# Altium schematic sheet Sheet2.SchDoc
size B; Organization: Altium Limited; Address1: L3, 12a Rodborough Rd; Address2: Frenchs Forest; Address3: NSW; Address4: Australia 2086
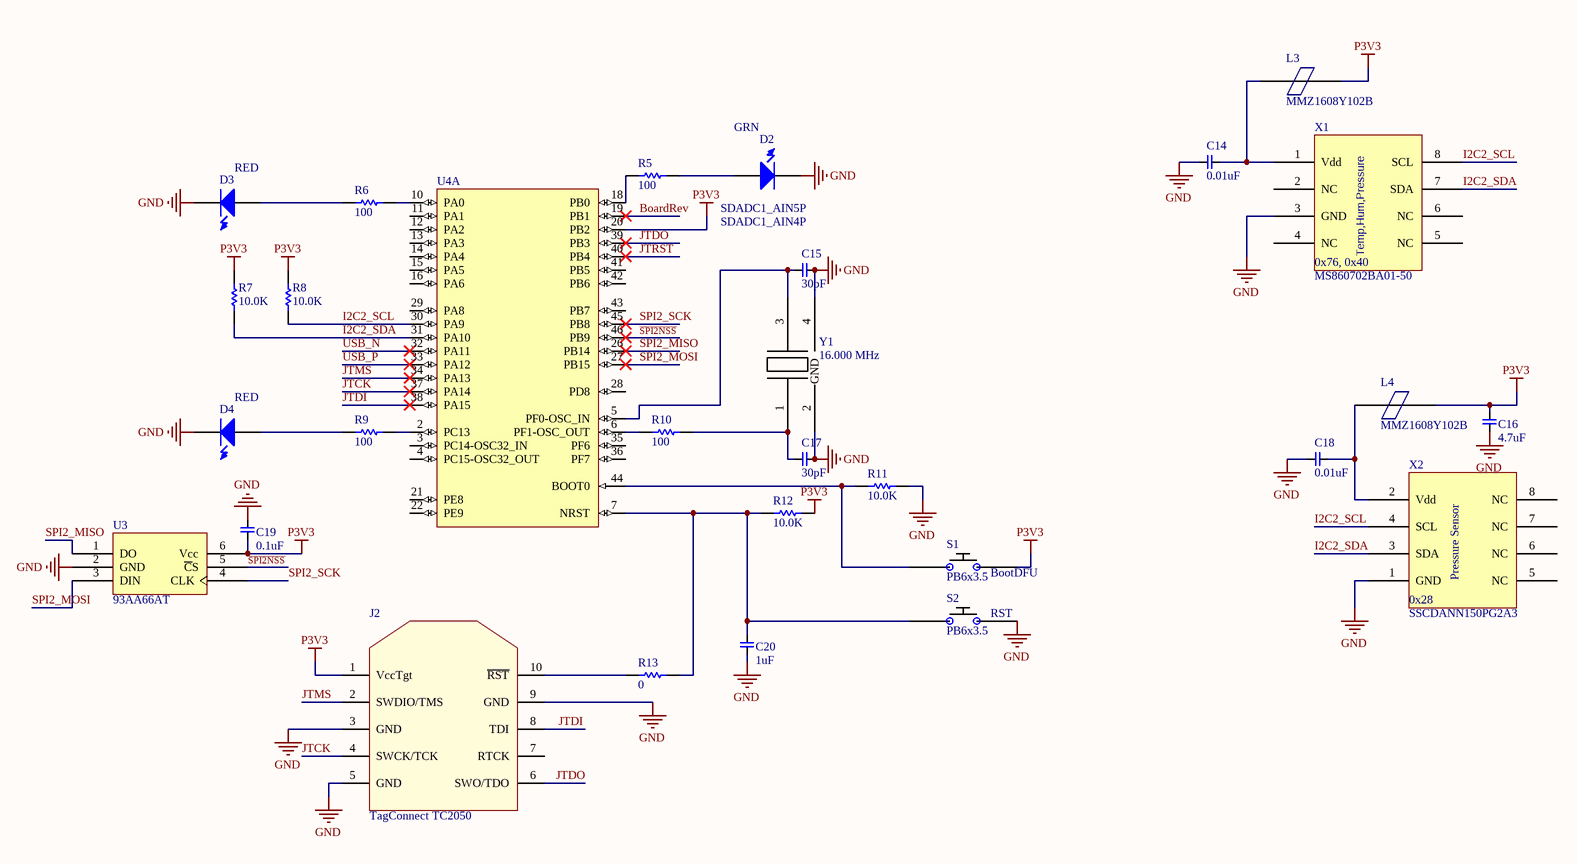
[diagram p0: Sheet2.SchDoc]

## Parts
C14  0.01uF  [CAP0402]
C15  30pF  [CAP0402]
C16  4.7uF  [CAP0603]
C17  30pF  [CAP0402]
C18  0.01uF  [CAP0402]
C19  0.1uF  [CAP0402]
C20  1uF  [CAP0402]
D2  GRN  [KINGBRIGHT_LED]
D3  RED  [KINGBRIGHT_LED]
D4  RED  [KINGBRIGHT_LED]
J2  TagConnect TC2050  [TC2050-IDC]  (no BOM)
L3  MMZ1608Y102B  [INDC1608X06N]
L4  MMZ1608Y102B  [INDC1608X06N]
R5  100  [RES0402]
R6  100  [RES0402]
R7  10.0K  [RES0402]
R8  10.0K  [RES0402]
R9  100  [RES0402]
R10  100  [RES0402]
R11  10.0K  [RES0402]
R12  10.0K  [RES0402]
R13  0  [RES0402]
S1  PB6x3.5  [PTS635]
S2  PB6x3.5  [PTS635]
U3  93AA66AT  [SOT-23-OT6_M]
U4  (no value)  [STM-LQFP48_N]  (part A of 2)
X1  MS860702BA01-50  [TETempHumidityPressSens]
X2  SSCDANN150PG2A3  [HoneywellPsenseDIP]
Y1  16.000 MHz  [CRYSTAL_SMD_3.2x2.5]

## Nets
GND: C14.2 C15.1 C16.2 C17.1 C18.2 C19.2 C20.1 D2.2(K) D3.2(K) D4.2(K) J2.3(GND) J2.5(GND) J2.9(GND) R11.2 S2.2 U3.2(GND) X1.3(GND) X2.1(GND) Y1.2(GND) Y1.4
P3V3: C16.1 C19.1 J2.1(VccTgt) L3.2 L4.2 R7.1 R8.1 R12.2 S1.2 U3.6(Vcc) U4.20(PB2)
~{SPI2NSS}: U3.5(~{C}S) U4.46(PB9)
BoardRev: U4.19(PB1)
I2C2_SCL: R8.2 U4.30(PA9) X1.8(SCL) X2.4(SCL)
I2C2_SDA: R7.2 U4.31(PA10) X1.7(SDA) X2.3(SDA)
JTCK: J2.4(SWCK/TCK) U4.37(PA14)
JTDI: J2.8(TDI) U4.38(PA15)
JTDO: J2.6(SWO/TDO) U4.39(PB3)
JTMS: J2.2(SWDIO/TMS) U4.34(PA13)
JTRST: U4.40(PB4)
SPI2_MISO: U3.1(DO) U4.26(PB14)
SPI2_MOSI: U3.3(DIN) U4.27(PB15)
SPI2_SCK: U3.4(CLK) U4.45(PB8)
USB_N: U4.32(PA11)
USB_P: U4.33(PA12)
NetC14_1: C14.1 L3.1 X1.1(Vdd)
NetC15_2: C15.2 U4.5(PF0-OSC_IN) Y1.3
NetC17_2: C17.2 R10.2 Y1.1
NetC18_1: C18.1 L4.1 X2.2(Vdd)
NetC20_2: C20.2 R12.1 R13.2 S2.1 U4.7(NRST)
NetD2_1: D2.1(A) R5.2
NetD3_1: D3.1(A) R6.1
NetD4_1: D4.1(A) R9.1
NetJ2_10: J2.10(~{RST}) R13.1
NetR5_1: R5.1 U4.18(PB0)
NetR6_2: R6.2 U4.10(PA0)
NetR9_2: R9.2 U4.2(PC13)
NetR10_1: R10.1 U4.6(PF1-OSC_OUT)
NetR11_1: R11.1 S1.1 U4.44(BOOT0)

Not connected (* = marked no-connect by the designer): J2 7(RTCK); U4 3(PC14-OSC32_IN) 4(PC15-OSC32_OUT) 11(PA1) 12(PA2) 13(PA3) 14(PA4) 15(PA5) 16(PA6) 21(PE8) 22(PE9) 28(PD8) 29(PA8) 35(PF6) 36(PF7) 41(PB5) 42(PB6) 43(PB7); X1 2(NC) 4(NC) 5(NC) 6(NC); X2 5(NC) 6(NC) 7(NC) 8(NC)

## Notes on the sheet
- (near D2) SDADC1_AIN5P
- SDADC1_AIN4P
- (near S1) BootDFU
- (near S2) RST
- Title
- Size:
- Date:
- File:
- C
- Number:
- Time:
- Revision:
- Sheet
- of
- (in symbol MS860702BA01-50) Temp,Hum,Pressure; 0x76, 0x40
- (in symbol SSCDANN150PG2A3) Pressure Sensor; 0x28

## Library data of the parts
C14 C18 = 514: CAP 0.01uF +/-20% 50V X6S 0402; Manufacturer: TDK; Manufacturer PN: C1005X6S1H103M; ID: 514; PkgCode: 0402; Value: 0.01uF; Tolerance: +/-20%; Voltage: 50V; Dielectric: X6S; ComponentLink1Description: Datasheet; ComponentLink1URL: http://www.tdk.com/pdf/general_B11.pdf; MaxComponentHeight: 0.55mm
C15 C17 = 388: CAP 30pF +/-5% 50V C0G 0402; Manufacturer: TDK; Manufacturer PN: C1005C0G1H300J; ID: 388; PkgCode: 0402; Value: 30pF; Tolerance: +/-5%; Voltage: 50V; Dielectric: C0G; ComponentLink1Description: Datasheet; ComponentLink1URL: http://www.tdk.com/pdf/general_B11.pdf; MaxComponentHeight: 0.55mm
C16 = 878: CAP 4.7uF +/-10% 10V X6S 0603; Manufacturer: TDK; Manufacturer PN: C1608X6S1A475K; ID: 878; PkgCode: 0603; Value: 4.7uF; Tolerance: +/-10%; Voltage: 10V; Dielectric: X6S; ComponentLink1Description: Datasheet; ComponentLink1URL: http://www.tdk.com/pdf/general_B11.pdf; MaxComponentHeight: 0.9mm
C19 = 485: CAP 0.1uF +/-10% 25V X7R 0402; Manufacturer: TDK; Manufacturer PN: C1005X7R1E104K; ID: 485; PkgCode: 0402; Value: 0.1uF; Tolerance: +/-10%; Voltage: 25V; Dielectric: X7R; ComponentLink1Description: Datasheet; ComponentLink1URL: http://www.tdk.com/pdf/general_B11.pdf; MaxComponentHeight: 0.55mm
C20 = 596: CAP 1uF +/-10% 10V X5R 0402; Manufacturer: TDK; Manufacturer PN: C1005X5R1A105K; ID: 596; PkgCode: 0402; Value: 1uF; Tolerance: +/-10%; Voltage: 10V; Dielectric: X5R; ComponentLink1Description: Datasheet; ComponentLink1URL: http://www.tdk.com/pdf/general_B11.pdf; MaxComponentHeight: 0.55mm
D2 = LED_GRN_SMD_0603: LED 1.6X0.8MM 568NM GRN CLR SMD; Manufacturer: Kingbright; Manufacturer PN: APT1608SGC; ComponentLink1Description: Datasheet; ComponentLink1URL: http://www.us.kingbright.com/images/catalog/SPEC/APT1608SURCK.pdf; Supplier 1: Mouser; Supplier Part Number 1: 604-APT1608SGC; Supplier 2: Newark; Supplier Part Number 2: 75R0578; Supplier 3: Digi-Key; Supplier Part Number 3: 754-1121-1-ND
D3 D4 = LED_RED_SMD_0603: LED 1.6X0.8MM 630NM RED CLR SMD; Manufacturer: Kingbright; Manufacturer PN: APT1608SURCK; ComponentLink1Description: Datasheet; ComponentLink1URL: http://www.us.kingbright.com/images/catalog/SPEC/APT1608SURCK.pdf; Supplier 1: Mouser; Supplier Part Number 1: 604-APT1608SURCK; Supplier 2: Digi-Key; Supplier Part Number 2: 754-1123-1-ND; Supplier 3: Newark; Supplier Part Number 3: 75R0573
J2 = TC2050_ARMJTAG: TagConnect TC2050-IDC For ARM JTAG; Manufacturer: Tag-Connect LLC; Manufacturer PN: TC2050-IDC; ComponentLink1Description: Datasheet; ComponentLink1URL: http://www.tag-connect.com/Materials/TC2050-IDC%20Datasheet.pdf
L3 L4 = MMZ1608Y102B: Ferrite, 1000oh, 400mA, 0603; ComponentLink1Description: Datasheet; ComponentLink1URL: http://www.tdk.co.jp/tefe02/e9412_mmz.pdf; Supplier 1: Newark; Supplier 2: Digi-Key; Supplier Part Number 1: 33P7606; Supplier Part Number 2: 445-1552-1-ND
R5 R6 R9 R10 = 771: Resistor SMT 0402 100 1% ohm; Manufacturer: Vishay; Manufacturer PN: CRCW0402100RFKED; ID: 771; Tempco: 100ppm/C; Power: 1/16W; PkgCode: 0402; Value: 100; Tolerance: 1%; Supplier 1: Digi-Key; Supplier Part Number 1: 541-100LCT-ND; ComponentLink1Description: Datasheet; ComponentLink1URL: http://www.vishay.com/docs/20035/dcrcwe3.pdf
R7 R8 R11 R12 = 963: Resistor SMT 0402 10.0K 1% ohm; Manufacturer: Vishay; Manufacturer PN: CRCW040210K0FKED; ID: 963; Tempco: 100ppm/C; Power: 1/16W; PkgCode: 0402; Value: 10.0K; Tolerance: 1%; Supplier 1: Digi-Key; Supplier Part Number 1: 541-10.0KLCT-ND; ComponentLink1Description: Datasheet; ComponentLink1URL: http://www.vishay.com/docs/20035/dcrcwe3.pdf
R13 = 578: Resistor SMT 0402 0 1% ohm; Manufacturer: Vishay; Manufacturer PN: CRCW04020000Z0ED; ID: 578; Tempco: 100ppm/C; Power: 1/16W; PkgCode: 0402; Value: 0; Tolerance: 1%; Supplier 1: Digi-Key; Supplier Part Number 1: 541-0.0JCT-ND; ComponentLink1Description: Datasheet; ComponentLink1URL: http://www.vishay.com/docs/20035/dcrcwe3.pdf
S1 S2 = PushButton_6x3.5mm: SWITCH TACTILE SPST-NO 0.05A 12V 6x3.5MM; Manufacturer: C&K Components; Manufacturer PN: RS-282G05A3-SM RT; ComponentLink1Description: Datasheet; ComponentLink1URL: http://www.ck-components.com/index.php?module=media&action=Display&cmpref=14408&lang=en&width=&height=&format=&alt=; Supplier 1: Digi-Key; Supplier Part Number 1: CKN10384CT-ND; Supplier 2: Arrow; Supplier Part Number 2: XEA-FyxNPVAE8Jp5x5vU7fJ1AuYvsxXnd5y73BrBtfw
U3 = 93AA66AT_SOT23-6: IC EEPROM 4KBIT 2MHZ SOT23-6; Manufacturer: Microchip Technology; Manufacturer PN: 93AA66AT-I/OT; ComponentLink1Description: Datasheet; ComponentLink1URL: http://www.microchip.com/mymicrochip/filehandler.aspx?ddocname=en011819; Supplier 1: Digi-Key; Supplier Part Number 1: 93AA66AT-I/OTCT-ND
U4 = STM32F373CCT6: ARM Cortex-M4 32-bit MCU, 256 KB Flash, 32 KB Internal RAM, 36 I/Os, 48-pin LQFP, -40 to 85 degC, Tray; FLASH Size (Prog) (kB): 256; I/Os (High Current): 36; Internal RAM Size (kB): 32; Operating Frequency(F) (Processor speed) (MHz): 72; Supply Voltage(Vcc) min (V): 2; DatasheetVersion: Rev. 3; PackageVersion: Rev. 6, 06/2013; PackageReference: LQFP48; PackageDescription: 48-Pin Low Profile Quad Flat Package, 7 x 7 mm Body, 0.5 mm Pitch; Supplier 1: Digi-Key; Supplier Part Number 1: 497-13251-ND; Supplier 2: Farnell; Supplier Part Number 2: 2215117; Supplier 3: Newark; Supplier Part Number 3: 46W2195; Supplier 4: Newark; Supplier Part Number 4: 48W6893; Supplier 5: Mouser; Supplier Part Number 5: 511-STM32F373CCT6; Core: ARM Cortex-M4; Packing: Tray; Mounting Technology: Surface Mount; PartNumber: STM32F373CCT6; ComponentLink1Description: Manufacturer URL; ComponentLink1URL: http://www.st.com/web/en/home.html; ComponentLink2Description: Datasheet; ComponentLink2URL: http://www.st.com/st-web-ui/static/active/en/resource/technical/document/datasheet/DM00046749.pdf; ComponentLink3Description: Package Specification; ComponentLink3URL: http://www.st.com/st-web-ui/static/active/en/resource/technical/document/datasheet/DM00058181.pdf
X1 = MS860702BA01-50: Humidity, Pressure, Temperature Sensor I²C Output; Manufacturer: TE Connectivity; ManufacturerPN: MS860702BA01-50; ComponentLink1Description: Datasheet; ComponentLink1URL: http://www.te.com/commerce/DocumentDelivery/DDEController?Action=srchrtrv&DocNm=MS8607-02BA01&DocType=DS&DocLang=English; Supplier 1: Digi-Key; Supplier Part Number 1: 223-1701-1-ND
X2 = SSCDANN150PG2A3: SENSOR PRES 150PSI GAUG 3.3V DIP I2C; Manufacturer: Honeywell; ComponentLink1Description: Datasheet; ComponentLink1URL: http://sensing.honeywell.com/index.php?ci_id=151134; Supplier 1: Digi-Key; Supplier 2: Allied; Supplier Part Number 1: 480-5413-ND; Supplier Part Number 2: 70280311; ManufacturerPN: SSCDANN150PG2A3
Y1 = Crystal_16.00MHz_SMD: CRYSTAL 16.0MHZ 20PF,80ohm PARALLEL SMD +/-10PPM; Manufacturer: CTS-Frequency Controls; Manufacturer PN: 403C11E16M00000; ComponentLink1Description: Datasheet; ComponentLink1URL: http://www.ctscorp.com/wp-content/uploads/403.pdf; Supplier 1: Digi-Key; Supplier Part Number 1: CTX732CT-ND; Rm: 80 ohm; CL: 20pf